# Altium project Thermistor_Expansion_Board.PrjPcb
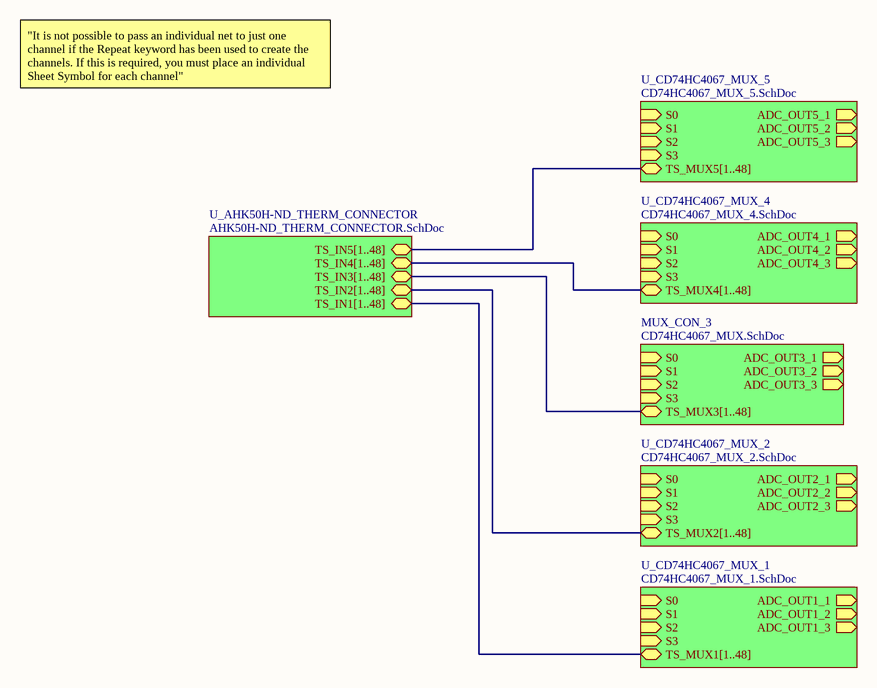
[diagram p0: TOP_SHEET.SchDoc]
6 sheets, 53 parts. Net scope: global (net labels, ports and power ports of the same name join across sheets).
Board file: MUX_Connectivity.PcbDoc
Sheets:
  TOP_SHEET.SchDoc
    MUX_CON_3 = CD74HC4067_MUX.SchDoc
    U_AHK50H-ND_THERM_CONNECTOR = AHK50H-ND_THERM_CONNECTOR.SchDoc
    U_CD74HC4067_MUX_5 = CD74HC4067_MUX_5.SchDoc
    U_CD74HC4067_MUX_2 = CD74HC4067_MUX_2.SchDoc
    U_CD74HC4067_MUX_1 = CD74HC4067_MUX_1.SchDoc

## Sheet TOP_SHEET.SchDoc
size A

### Sub-sheets
MUX_CON_3 = CD74HC4067_MUX.SchDoc: TS_MUX3[1..48] (bidir), S0 (in), S1 (in), S2 (in), S3 (in), ADC_OUT3_1 (out), ADC_OUT3_2 (out), ADC_OUT3_3 (out)
U_AHK50H-ND_THERM_CONNECTOR = AHK50H-ND_THERM_CONNECTOR.SchDoc: TS_IN3[1..48] (bidir), TS_IN2[1..48] (bidir), TS_IN1[1..48] (bidir), TS_IN4[1..48] (bidir), TS_IN5[1..48] (bidir)
U_CD74HC4067_MUX_1 = CD74HC4067_MUX_1.SchDoc: S0 (in), S1 (in), S2 (in), S3 (in), ADC_OUT1_1 (out), ADC_OUT1_2 (out), ADC_OUT1_3 (out), TS_MUX1[1..48] (bidir)
U_CD74HC4067_MUX_2 = CD74HC4067_MUX_2.SchDoc: S0 (in), S1 (in), S2 (in), S3 (in), ADC_OUT2_1 (out), ADC_OUT2_2 (out), ADC_OUT2_3 (out), TS_MUX2[1..48] (bidir)
U_CD74HC4067_MUX_4 = CD74HC4067_MUX_4.SchDoc (file not in this document): S0 (in), S1 (in), S2 (in), S3 (in), ADC_OUT4_1 (out), ADC_OUT4_2 (out), ADC_OUT4_3 (out), TS_MUX4[1..48] (bidir)
U_CD74HC4067_MUX_5 = CD74HC4067_MUX_5.SchDoc: S0 (in), S1 (in), S2 (in), S3 (in), ADC_OUT5_1 (out), ADC_OUT5_2 (out), ADC_OUT5_3 (out), TS_MUX5[1..48] (bidir)

### Buses and harness runs
bus sheet MUX_CON_3/TS_MUX3[1..48] = sheet U_AHK50H-ND_THERM_CONNECTOR/TS_IN3[1..48]
bus sheet U_AHK50H-ND_THERM_CONNECTOR/TS_IN1[1..48] = sheet U_CD74HC4067_MUX_1/TS_MUX1[1..48]
bus sheet U_AHK50H-ND_THERM_CONNECTOR/TS_IN2[1..48] = sheet U_CD74HC4067_MUX_2/TS_MUX2[1..48]
bus sheet U_AHK50H-ND_THERM_CONNECTOR/TS_IN4[1..48] = sheet U_CD74HC4067_MUX_4/TS_MUX4[1..48]
bus sheet U_AHK50H-ND_THERM_CONNECTOR/TS_IN5[1..48] = sheet U_CD74HC4067_MUX_5/TS_MUX5[1..48]

### Notes on the sheet
- "It is not possible to pass an individual net to just one channel if the Repeat keyword has been used to create the channels. If this is required, you must place an individual Sheet Symbol for each channel"

## Sheet CD74HC4067_MUX.SchDoc
size A
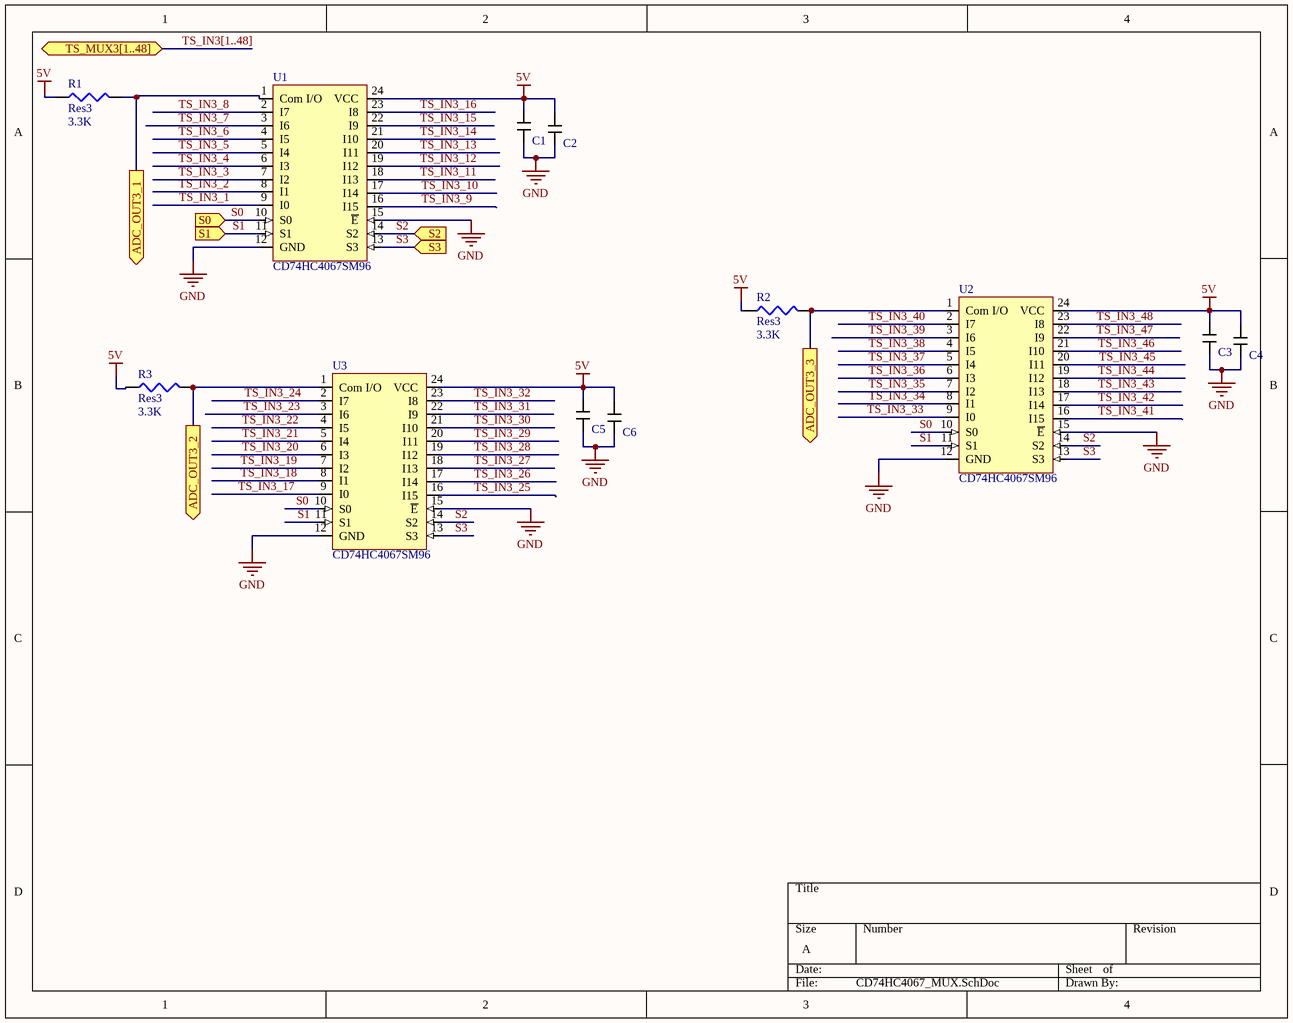
[diagram p1: CD74HC4067_MUX.SchDoc]

### Parts
C1  0.1uF Cap  [CAPC1608X09M]  (value not drawn)
C2  1uF Samsung Cap  [CAPC1608X09M]  (value not drawn)
C3  0.1uF Cap  [CAPC1608X09M]  (value not drawn)
C4  1uF Samsung Cap  [CAPC1608X09M]  (value not drawn)
C5  0.1uF Cap  [CAPC1608X09M]  (value not drawn)
C6  1uF Samsung Cap  [CAPC1608X09M]  (value not drawn)
R1  Res3  value 3.3K  [J1-0603]
R2  Res3  value 3.3K  [J1-0603]
R3  Res3  value 3.3K  [J1-0603]
U1  CD74HC4067SM96  [SOIC-24_MUX]
U2  CD74HC4067SM96  [SOIC-24_MUX]
U3  CD74HC4067SM96  [SOIC-24_MUX]

### Ports
ADC_OUT3_1 (out), ADC_OUT3_2 (out), ADC_OUT3_3 (out), S0 (in), S1 (in), S2 (in), S3 (in), TS_MUX3[1..48] (bidir)

### Nets
5V: C1.2 C2.2 C3.2 C4.2 C5.2 C6.2 R1.1 R2.1 R3.1 U1.24(VCC) U2.24(VCC) U3.24(VCC)
GND: C1.1 C2.1 C3.1 C4.1 C5.1 C6.1 U1.12(GND) U1.15(~{E}) U2.12(GND) U2.15(~{E}) U3.12(GND) U3.15(~{E})
S0: U1.10(S0) U2.10(S0) U3.10(S0) ; port S0
S1: U1.11(S1) U2.11(S1) U3.11(S1) ; port S1
S2: U1.14(S2) U2.14(S2) U3.14(S2) ; port S2
S3: U1.13(S3) U2.13(S3) U3.13(S3) ; port S3
TS_IN3_1: U1.9(I0)
TS_IN3_2: U1.8(I1)
TS_IN3_3: U1.7(I2)
TS_IN3_4: U1.6(I3)
TS_IN3_5: U1.5(I4)
TS_IN3_6: U1.4(I5)
TS_IN3_7: U1.3(I6)
TS_IN3_8: U1.2(I7)
TS_IN3_9: U1.16(I15)
TS_IN3_10: U1.17(I14)
TS_IN3_11: U1.18(I13)
TS_IN3_12: U1.19(I12)
TS_IN3_13: U1.20(I11)
TS_IN3_14: U1.21(I10)
TS_IN3_15: U1.22(I9)
TS_IN3_16: U1.23(I8)
TS_IN3_17: U3.9(I0)
TS_IN3_18: U3.8(I1)
TS_IN3_19: U3.7(I2)
TS_IN3_20: U3.6(I3)
TS_IN3_21: U3.5(I4)
TS_IN3_22: U3.4(I5)
TS_IN3_23: U3.3(I6)
TS_IN3_24: U3.2(I7)
TS_IN3_25: U3.16(I15)
TS_IN3_26: U3.17(I14)
TS_IN3_27: U3.18(I13)
TS_IN3_28: U3.19(I12)
TS_IN3_29: U3.20(I11)
TS_IN3_30: U3.21(I10)
TS_IN3_31: U3.22(I9)
TS_IN3_32: U3.23(I8)
TS_IN3_33: U2.9(I0)
TS_IN3_34: U2.8(I1)
TS_IN3_35: U2.7(I2)
TS_IN3_36: U2.6(I3)
TS_IN3_37: U2.5(I4)
TS_IN3_38: U2.4(I5)
TS_IN3_39: U2.3(I6)
TS_IN3_40: U2.2(I7)
TS_IN3_41: U2.16(I15)
TS_IN3_42: U2.17(I14)
TS_IN3_43: U2.18(I13)
TS_IN3_44: U2.19(I12)
TS_IN3_45: U2.20(I11)
TS_IN3_46: U2.21(I10)
TS_IN3_47: U2.22(I9)
TS_IN3_48: U2.23(I8)
NetR1_2: R1.2 U1.1(Com_I/O) ; port ADC_OUT3_1
NetR2_2: R2.2 U2.1(Com_I/O) ; port ADC_OUT3_3
NetR3_2: R3.2 U3.1(Com_I/O) ; port ADC_OUT3_2

### Buses and harness runs
bus TS_IN3[1..48] = port TS_MUX3[1..48]

### Library data of the parts
C1 C3 C5 = 0.1uF Cap: C0603C101K8GAC7867 Kemet Capacitor; Supplier 1: Digi-Key; Supplier Part Number 1: 399-14477-1-ND
R1-R3 = Res3: Resistor; Published: 8-Jun-2000; LatestRevisionDate: 29-May-2009; LatestRevisionNote: IPC-7351 Footprint Added.; PackageReference: J1-0603; Publisher: Altium Limited; PackageDescription: Chip Resistor
C2 C4 C6 = 1uF Samsung Cap: Supplier 1: Digi-Key; Supplier Part Number 1: 1276-1946-1-ND
U1-U3 = CD74HC4067SM96: Supplier Part Number 1: 05B6161; Supplier 1: Newark

## Sheet AHK50H-ND_THERM_CONNECTOR.SchDoc
size A
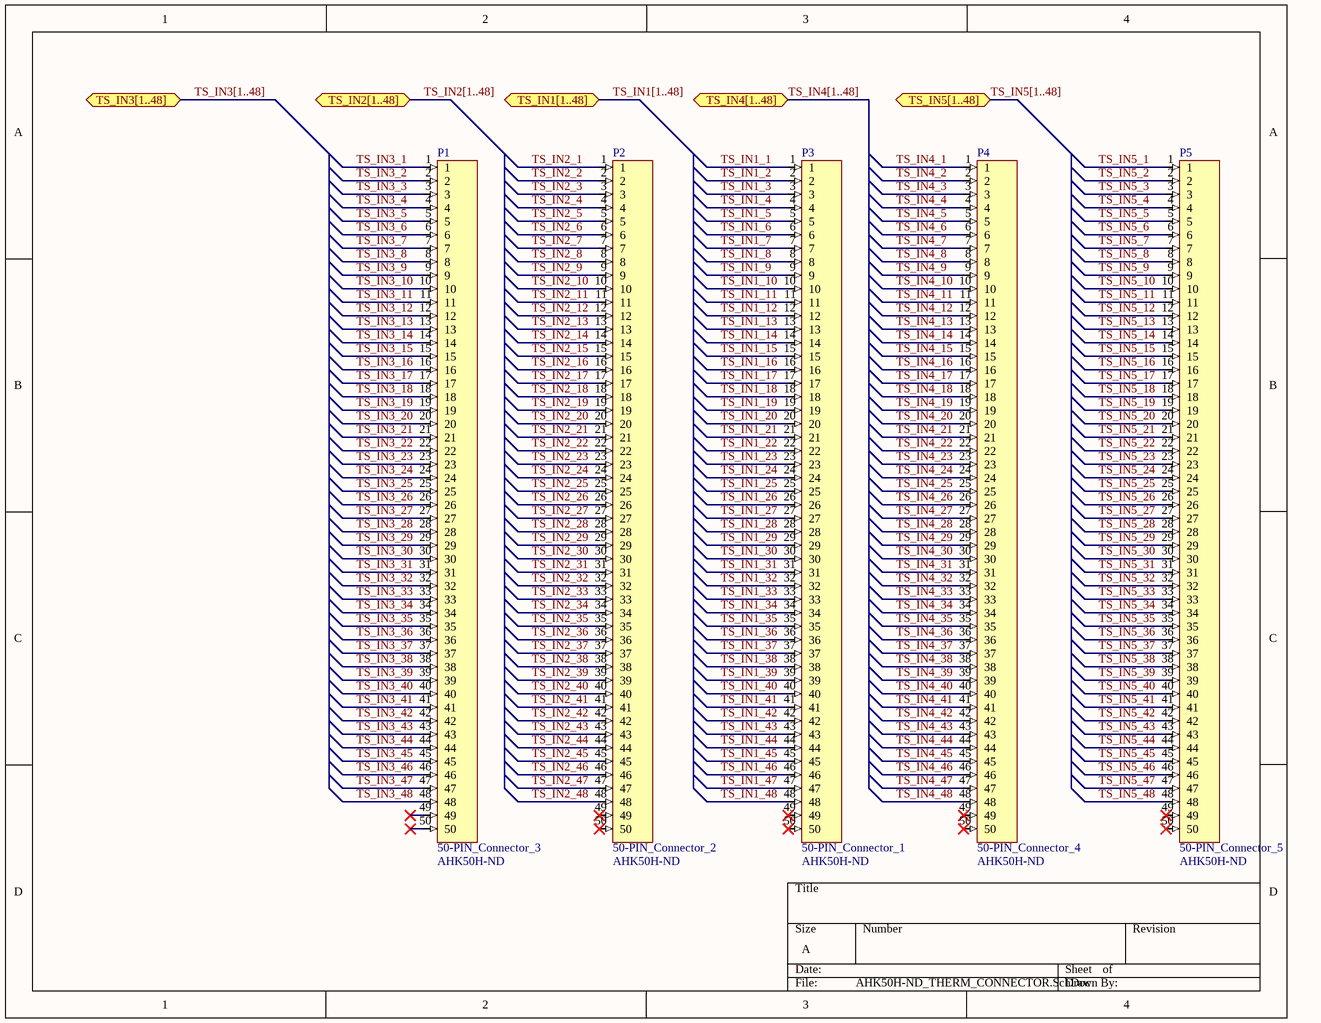
[diagram p2: AHK50H-ND_THERM_CONNECTOR.SchDoc]

### Parts
P1  50-PIN_Connector_3  Supplier Part Number 1: AHK50H-ND  [50_Pin_Connector]
P2  50-PIN_Connector_2  Supplier Part Number 1: AHK50H-ND  [50_Pin_Connector]
P3  50-PIN_Connector_1  Supplier Part Number 1: AHK50H-ND  [50_Pin_Connector]
P4  50-PIN_Connector_4  Supplier Part Number 1: AHK50H-ND  [50_Pin_Connector]
P5  50-PIN_Connector_5  Supplier Part Number 1: AHK50H-ND  [50_Pin_Connector]

### Ports
TS_IN1[1..48] (bidir), TS_IN2[1..48] (bidir), TS_IN3[1..48] (bidir), TS_IN4[1..48] (bidir), TS_IN5[1..48] (bidir)

### Nets
TS_IN1_1: P3.1
TS_IN1_2: P3.2
TS_IN1_3: P3.3
TS_IN1_4: P3.4
TS_IN1_5: P3.5
TS_IN1_6: P3.6
TS_IN1_7: P3.7
TS_IN1_8: P3.8
TS_IN1_9: P3.9
TS_IN1_10: P3.10
TS_IN1_11: P3.11
TS_IN1_12: P3.12
TS_IN1_13: P3.13
TS_IN1_14: P3.14
TS_IN1_15: P3.15
TS_IN1_16: P3.16
TS_IN1_17: P3.17
TS_IN1_18: P3.18
TS_IN1_19: P3.19
TS_IN1_20: P3.20
TS_IN1_21: P3.21
TS_IN1_22: P3.22
TS_IN1_23: P3.23
TS_IN1_24: P3.24
TS_IN1_25: P3.25
TS_IN1_26: P3.26
TS_IN1_27: P3.27
TS_IN1_28: P3.28
TS_IN1_29: P3.29
TS_IN1_30: P3.30
TS_IN1_31: P3.31
TS_IN1_32: P3.32
TS_IN1_33: P3.33
TS_IN1_34: P3.34
TS_IN1_35: P3.35
TS_IN1_36: P3.36
TS_IN1_37: P3.37
TS_IN1_38: P3.38
TS_IN1_39: P3.39
TS_IN1_40: P3.40
TS_IN1_41: P3.41
TS_IN1_42: P3.42
TS_IN1_43: P3.43
TS_IN1_44: P3.44
TS_IN1_45: P3.45
TS_IN1_46: P3.46
TS_IN1_47: P3.47
TS_IN1_48: P3.48
TS_IN2_1: P2.1
TS_IN2_2: P2.2
TS_IN2_3: P2.3
TS_IN2_4: P2.4
TS_IN2_5: P2.5
TS_IN2_6: P2.6
TS_IN2_7: P2.7
TS_IN2_8: P2.8
TS_IN2_9: P2.9
TS_IN2_10: P2.10
TS_IN2_11: P2.11
TS_IN2_12: P2.12
TS_IN2_13: P2.13
TS_IN2_14: P2.14
TS_IN2_15: P2.15
TS_IN2_16: P2.16
TS_IN2_17: P2.17
TS_IN2_18: P2.18
TS_IN2_19: P2.19
TS_IN2_20: P2.20
TS_IN2_21: P2.21
TS_IN2_22: P2.22
TS_IN2_23: P2.23
TS_IN2_24: P2.24
TS_IN2_25: P2.25
TS_IN2_26: P2.26
TS_IN2_27: P2.27
TS_IN2_28: P2.28
TS_IN2_29: P2.29
TS_IN2_30: P2.30
TS_IN2_31: P2.31
TS_IN2_32: P2.32
TS_IN2_33: P2.33
TS_IN2_34: P2.34
TS_IN2_35: P2.35
TS_IN2_36: P2.36
TS_IN2_37: P2.37
TS_IN2_38: P2.38
TS_IN2_39: P2.39
TS_IN2_40: P2.40
TS_IN2_41: P2.41
TS_IN2_42: P2.42
TS_IN2_43: P2.43
TS_IN2_44: P2.44
TS_IN2_45: P2.45
TS_IN2_46: P2.46
TS_IN2_47: P2.47
TS_IN2_48: P2.48
TS_IN3_1: P1.1
TS_IN3_2: P1.2
TS_IN3_3: P1.3
TS_IN3_4: P1.4
TS_IN3_5: P1.5
TS_IN3_6: P1.6
TS_IN3_7: P1.7
TS_IN3_8: P1.8
TS_IN3_9: P1.9
TS_IN3_10: P1.10
TS_IN3_11: P1.11
TS_IN3_12: P1.12
TS_IN3_13: P1.13
TS_IN3_14: P1.14
TS_IN3_15: P1.15
TS_IN3_16: P1.16
TS_IN3_17: P1.17
TS_IN3_18: P1.18
TS_IN3_19: P1.19
TS_IN3_20: P1.20
TS_IN3_21: P1.21
TS_IN3_22: P1.22
TS_IN3_23: P1.23
TS_IN3_24: P1.24
TS_IN3_25: P1.25
TS_IN3_26: P1.26
TS_IN3_27: P1.27
TS_IN3_28: P1.28
TS_IN3_29: P1.29
TS_IN3_30: P1.30
TS_IN3_31: P1.31
TS_IN3_32: P1.32
TS_IN3_33: P1.33
TS_IN3_34: P1.34
TS_IN3_35: P1.35
TS_IN3_36: P1.36
TS_IN3_37: P1.37
TS_IN3_38: P1.38
TS_IN3_39: P1.39
TS_IN3_40: P1.40
TS_IN3_41: P1.41
TS_IN3_42: P1.42
TS_IN3_43: P1.43
TS_IN3_44: P1.44
TS_IN3_45: P1.45
TS_IN3_46: P1.46
TS_IN3_47: P1.47
TS_IN3_48: P1.48
TS_IN4_1: P4.1
TS_IN4_2: P4.2
TS_IN4_3: P4.3
TS_IN4_4: P4.4
TS_IN4_5: P4.5
TS_IN4_6: P4.6
TS_IN4_7: P4.7
TS_IN4_8: P4.8
TS_IN4_9: P4.9
TS_IN4_10: P4.10
TS_IN4_11: P4.11
TS_IN4_12: P4.12
TS_IN4_13: P4.13
TS_IN4_14: P4.14
TS_IN4_15: P4.15
TS_IN4_16: P4.16
TS_IN4_17: P4.17
TS_IN4_18: P4.18
TS_IN4_19: P4.19
TS_IN4_20: P4.20
TS_IN4_21: P4.21
TS_IN4_22: P4.22
TS_IN4_23: P4.23
TS_IN4_24: P4.24
TS_IN4_25: P4.25
TS_IN4_26: P4.26
TS_IN4_27: P4.27
TS_IN4_28: P4.28
TS_IN4_29: P4.29
TS_IN4_30: P4.30
TS_IN4_31: P4.31
TS_IN4_32: P4.32
TS_IN4_33: P4.33
TS_IN4_34: P4.34
TS_IN4_35: P4.35
TS_IN4_36: P4.36
TS_IN4_37: P4.37
TS_IN4_38: P4.38
TS_IN4_39: P4.39
TS_IN4_40: P4.40
TS_IN4_41: P4.41
TS_IN4_42: P4.42
TS_IN4_43: P4.43
TS_IN4_44: P4.44
TS_IN4_45: P4.45
TS_IN4_46: P4.46
TS_IN4_47: P4.47
TS_IN4_48: P4.48
TS_IN5_1: P5.1
TS_IN5_2: P5.2
TS_IN5_3: P5.3
TS_IN5_4: P5.4
TS_IN5_5: P5.5
TS_IN5_6: P5.6
TS_IN5_7: P5.7
TS_IN5_8: P5.8
TS_IN5_9: P5.9
TS_IN5_10: P5.10
TS_IN5_11: P5.11
TS_IN5_12: P5.12
TS_IN5_13: P5.13
TS_IN5_14: P5.14
TS_IN5_15: P5.15
TS_IN5_16: P5.16
TS_IN5_17: P5.17
TS_IN5_18: P5.18
TS_IN5_19: P5.19
TS_IN5_20: P5.20
TS_IN5_21: P5.21
TS_IN5_22: P5.22
TS_IN5_23: P5.23
TS_IN5_24: P5.24
TS_IN5_25: P5.25
TS_IN5_26: P5.26
TS_IN5_27: P5.27
TS_IN5_28: P5.28
TS_IN5_29: P5.29
TS_IN5_30: P5.30
TS_IN5_31: P5.31
TS_IN5_32: P5.32
TS_IN5_33: P5.33
TS_IN5_34: P5.34
TS_IN5_35: P5.35
TS_IN5_36: P5.36
TS_IN5_37: P5.37
TS_IN5_38: P5.38
TS_IN5_39: P5.39
TS_IN5_40: P5.40
TS_IN5_41: P5.41
TS_IN5_42: P5.42
TS_IN5_43: P5.43
TS_IN5_44: P5.44
TS_IN5_45: P5.45
TS_IN5_46: P5.46
TS_IN5_47: P5.47
TS_IN5_48: P5.48

Not connected (* = marked no-connect by the designer): P1 49* 50*; P2 49* 50*; P3 49* 50*; P4 49* 50*; P5 49* 50*

### Buses and harness runs
bus TS_IN1[1..48] = port TS_IN1[1..48]
bus TS_IN2[1..48] = port TS_IN2[1..48]
bus TS_IN3[1..48] = port TS_IN3[1..48]
bus TS_IN4[1..48] = port TS_IN4[1..48]
bus TS_IN5[1..48] = port TS_IN5[1..48]

### Library data of the parts
P1-P5 = 50-PIN_Connector: TE_CONN_VERT_50-PIN; Supplier 1: Digi-Key

## Sheet CD74HC4067_MUX_5.SchDoc
size A
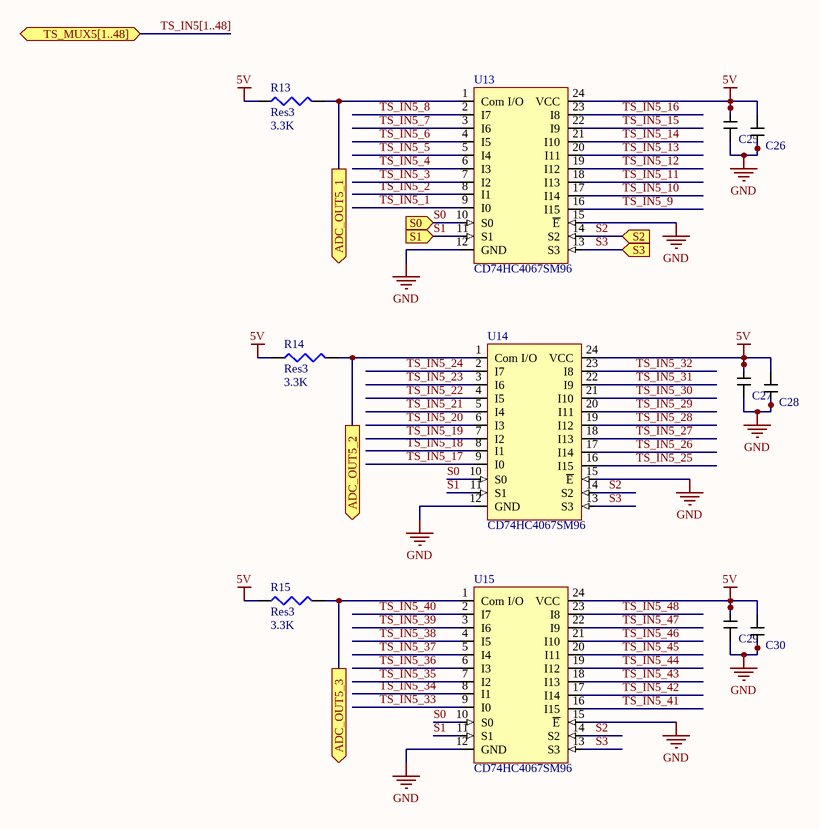
[diagram p3: CD74HC4067_MUX_5.SchDoc]

### Parts
C25  0.1uF Cap  [CAPC1608X09M]  (value not drawn)
C26  1uF Samsung Cap  [CAPC1608X09M]  (value not drawn)
C27  0.1uF Cap  [CAPC1608X09M]  (value not drawn)
C28  1uF Samsung Cap  [CAPC1608X09M]  (value not drawn)
C29  0.1uF Cap  [CAPC1608X09M]  (value not drawn)
C30  1uF Samsung Cap  [CAPC1608X09M]  (value not drawn)
R13  Res3  value 3.3K  [J1-0603]
R14  Res3  value 3.3K  [J1-0603]
R15  Res3  value 3.3K  [J1-0603]
U13  CD74HC4067SM96  [SOIC-24_MUX]
U14  CD74HC4067SM96  [SOIC-24_MUX]
U15  CD74HC4067SM96  [SOIC-24_MUX]

### Ports
ADC_OUT5_1 (out), ADC_OUT5_2 (out), ADC_OUT5_3 (out), S0 (in), S1 (in), S2 (in), S3 (in), TS_MUX5[1..48] (bidir)

### Nets
5V: C25.2 C26.2 C27.2 C28.2 C29.2 C30.2 R13.1 R14.1 R15.1 U13.24(VCC) U14.24(VCC) U15.24(VCC)
GND: C25.1 C26.1 C27.1 C28.1 C29.1 C30.1 U13.12(GND) U13.15(~{E}) U14.12(GND) U14.15(~{E}) U15.12(GND) U15.15(~{E})
S0: U13.10(S0) U14.10(S0) U15.10(S0) ; port S0
S1: U13.11(S1) U14.11(S1) U15.11(S1) ; port S1
S2: U13.14(S2) U14.14(S2) U15.14(S2) ; port S2
S3: U13.13(S3) U14.13(S3) U15.13(S3) ; port S3
TS_IN5_1: U13.9(I0)
TS_IN5_2: U13.8(I1)
TS_IN5_3: U13.7(I2)
TS_IN5_4: U13.6(I3)
TS_IN5_5: U13.5(I4)
TS_IN5_6: U13.4(I5)
TS_IN5_7: U13.3(I6)
TS_IN5_8: U13.2(I7)
TS_IN5_9: U13.16(I15)
TS_IN5_10: U13.17(I14)
TS_IN5_11: U13.18(I13)
TS_IN5_12: U13.19(I12)
TS_IN5_13: U13.20(I11)
TS_IN5_14: U13.21(I10)
TS_IN5_15: U13.22(I9)
TS_IN5_16: U13.23(I8)
TS_IN5_17: U14.9(I0)
TS_IN5_18: U14.8(I1)
TS_IN5_19: U14.7(I2)
TS_IN5_20: U14.6(I3)
TS_IN5_21: U14.5(I4)
TS_IN5_22: U14.4(I5)
TS_IN5_23: U14.3(I6)
TS_IN5_24: U14.2(I7)
TS_IN5_25: U14.16(I15)
TS_IN5_26: U14.17(I14)
TS_IN5_27: U14.18(I13)
TS_IN5_28: U14.19(I12)
TS_IN5_29: U14.20(I11)
TS_IN5_30: U14.21(I10)
TS_IN5_31: U14.22(I9)
TS_IN5_32: U14.23(I8)
TS_IN5_33: U15.9(I0)
TS_IN5_34: U15.8(I1)
TS_IN5_35: U15.7(I2)
TS_IN5_36: U15.6(I3)
TS_IN5_37: U15.5(I4)
TS_IN5_38: U15.4(I5)
TS_IN5_39: U15.3(I6)
TS_IN5_40: U15.2(I7)
TS_IN5_41: U15.16(I15)
TS_IN5_42: U15.17(I14)
TS_IN5_43: U15.18(I13)
TS_IN5_44: U15.19(I12)
TS_IN5_45: U15.20(I11)
TS_IN5_46: U15.21(I10)
TS_IN5_47: U15.22(I9)
TS_IN5_48: U15.23(I8)
NetR13_2: R13.2 U13.1(Com_I/O) ; port ADC_OUT5_1
NetR14_2: R14.2 U14.1(Com_I/O) ; port ADC_OUT5_2
NetR15_2: R15.2 U15.1(Com_I/O) ; port ADC_OUT5_3

### Buses and harness runs
bus TS_IN5[1..48] = port TS_MUX5[1..48]

### Library data of the parts
C25 C27 C29 = 0.1uF Cap: C0603C101K8GAC7867 Kemet Capacitor; Supplier 1: Digi-Key; Supplier Part Number 1: 399-14477-1-ND
R13-R15 = Res3: Resistor; Published: 8-Jun-2000; LatestRevisionDate: 29-May-2009; LatestRevisionNote: IPC-7351 Footprint Added.; PackageReference: J1-0603; Publisher: Altium Limited; PackageDescription: Chip Resistor
C26 C28 C30 = 1uF Samsung Cap: Supplier 1: Digi-Key; Supplier Part Number 1: 1276-1946-1-ND
U13-U15 = CD74HC4067SM96: Supplier Part Number 1: 05B6161; Supplier 1: Newark

## Sheet CD74HC4067_MUX_2.SchDoc
size A
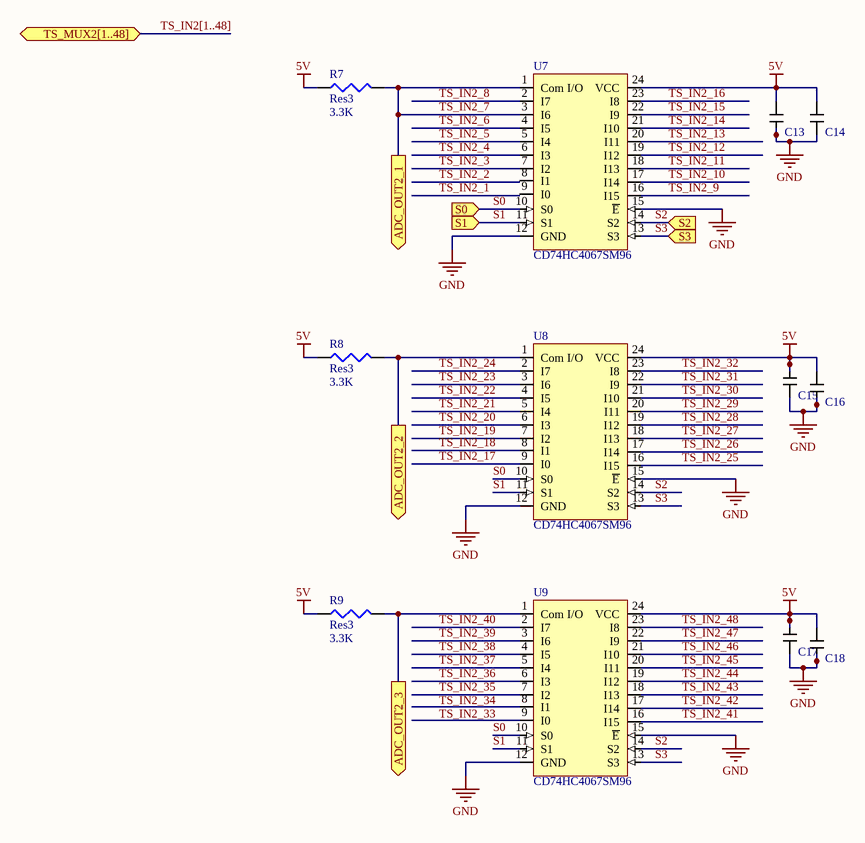
[diagram p4: CD74HC4067_MUX_2.SchDoc]

### Parts
C13  0.1uF Cap  [CAPC1608X09M]  (value not drawn)
C14  1uF Samsung Cap  [CAPC1608X09M]  (value not drawn)
C15  0.1uF Cap  [CAPC1608X09M]  (value not drawn)
C16  1uF Samsung Cap  [CAPC1608X09M]  (value not drawn)
C17  0.1uF Cap  [CAPC1608X09M]  (value not drawn)
C18  1uF Samsung Cap  [CAPC1608X09M]  (value not drawn)
R7  Res3  value 3.3K  [J1-0603]
R8  Res3  value 3.3K  [J1-0603]
R9  Res3  value 3.3K  [J1-0603]
U7  CD74HC4067SM96  [SOIC-24_MUX]
U8  CD74HC4067SM96  [SOIC-24_MUX]
U9  CD74HC4067SM96  [SOIC-24_MUX]

### Ports
ADC_OUT2_1 (out), ADC_OUT2_2 (out), ADC_OUT2_3 (out), S0 (in), S1 (in), S2 (in), S3 (in), TS_MUX2[1..48] (bidir)

### Nets
5V: C13.2 C14.2 C15.2 C16.2 C17.2 C18.2 R7.1 R8.1 R9.1 U7.24(VCC) U8.24(VCC) U9.24(VCC)
GND: C13.1 C14.1 C15.1 C16.1 C17.1 C18.1 U7.12(GND) U7.15(~{E}) U8.12(GND) U8.15(~{E}) U9.12(GND) U9.15(~{E})
S0: U7.10(S0) U8.10(S0) U9.10(S0) ; port S0
S1: U7.11(S1) U8.11(S1) U9.11(S1) ; port S1
S2: U7.14(S2) U8.14(S2) U9.14(S2) ; port S2
S3: U7.13(S3) U8.13(S3) U9.13(S3) ; port S3
TS_IN2_3: U7.7(I2)
TS_IN2_4: U7.6(I3)
TS_IN2_5: U7.5(I4)
TS_IN2_6: U7.4(I5)
TS_IN2_7: R7.2 U7.1(Com_I/O) U7.3(I6) ; port ADC_OUT2_1
TS_IN2_8: U7.2(I7)
TS_IN2_9: U7.16(I15)
TS_IN2_10: U7.17(I14)
TS_IN2_11: U7.18(I13)
TS_IN2_12: U7.19(I12)
TS_IN2_13: U7.20(I11)
TS_IN2_14: U7.21(I10)
TS_IN2_15: U7.22(I9)
TS_IN2_16: U7.23(I8)
TS_IN2_17: U8.9(I0)
TS_IN2_18: U8.8(I1)
TS_IN2_19: U8.7(I2)
TS_IN2_20: U8.6(I3)
TS_IN2_21: U8.5(I4)
TS_IN2_22: U8.4(I5)
TS_IN2_23: U8.3(I6)
TS_IN2_24: U8.2(I7)
TS_IN2_25: U8.16(I15)
TS_IN2_26: U8.17(I14)
TS_IN2_27: U8.18(I13)
TS_IN2_28: U8.19(I12)
TS_IN2_29: U8.20(I11)
TS_IN2_30: U8.21(I10)
TS_IN2_31: U8.22(I9)
TS_IN2_32: U8.23(I8)
TS_IN2_35: U9.7(I2)
TS_IN2_36: U9.6(I3)
TS_IN2_37: U9.5(I4)
TS_IN2_38: U9.4(I5)
TS_IN2_39: U9.3(I6)
TS_IN2_40: U9.2(I7)
TS_IN2_41: U9.16(I15)
TS_IN2_42: U9.17(I14)
TS_IN2_43: U9.18(I13)
TS_IN2_44: U9.19(I12)
TS_IN2_45: U9.20(I11)
TS_IN2_46: U9.21(I10)
TS_IN2_47: U9.22(I9)
TS_IN2_48: U9.23(I8)
NetR8_2: R8.2 U8.1(Com_I/O) ; port ADC_OUT2_2
NetR9_2: R9.2 U9.1(Com_I/O) ; port ADC_OUT2_3

Not connected (* = marked no-connect by the designer): U7 8(I1) 9(I0); U9 8(I1) 9(I0)

### Buses and harness runs
bus TS_IN2[1..48] = port TS_MUX2[1..48]

### Notes on the sheet
- Labels drawn without touching a wire or pin: TS_IN2_33, TS_IN2_34

### Library data of the parts
C13 C15 C17 = 0.1uF Cap: C0603C101K8GAC7867 Kemet Capacitor; Supplier 1: Digi-Key; Supplier Part Number 1: 399-14477-1-ND
R7-R9 = Res3: Resistor; Published: 8-Jun-2000; LatestRevisionDate: 29-May-2009; LatestRevisionNote: IPC-7351 Footprint Added.; PackageReference: J1-0603; Publisher: Altium Limited; PackageDescription: Chip Resistor
C14 C16 C18 = 1uF Samsung Cap: Supplier 1: Digi-Key; Supplier Part Number 1: 1276-1946-1-ND
U7-U9 = CD74HC4067SM96: Supplier Part Number 1: 05B6161; Supplier 1: Newark

## Sheet CD74HC4067_MUX_1.SchDoc
size A
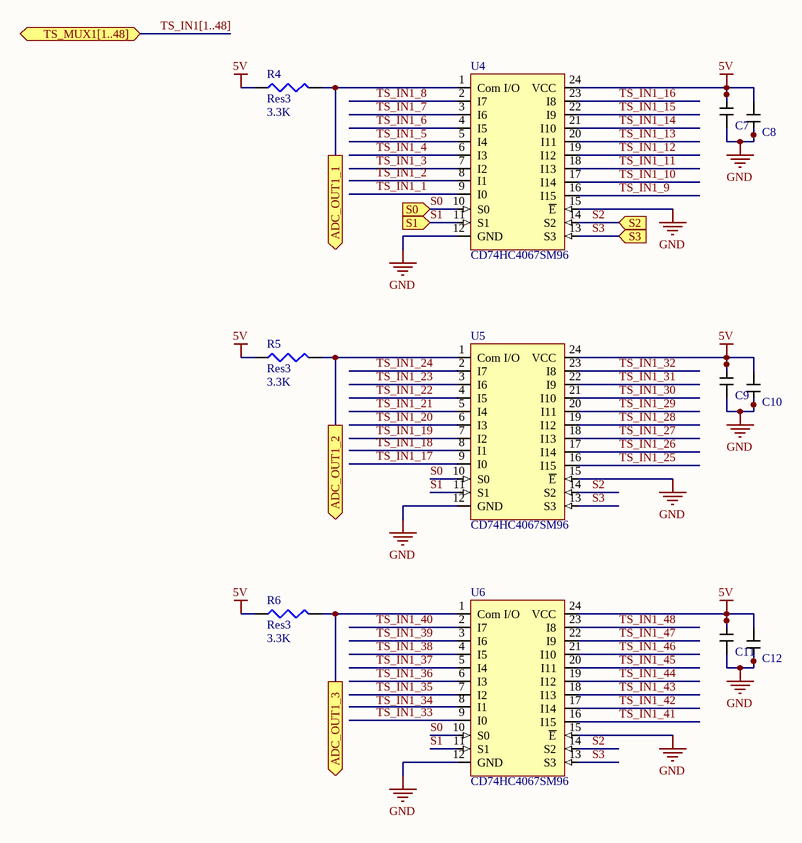
[diagram p5: CD74HC4067_MUX_1.SchDoc]

### Parts
C7  0.1uF Cap  [CAPC1608X09M]  (value not drawn)
C8  1uF Samsung Cap  [CAPC1608X09M]  (value not drawn)
C9  0.1uF Cap  [CAPC1608X09M]  (value not drawn)
C10  1uF Samsung Cap  [CAPC1608X09M]  (value not drawn)
C11  0.1uF Cap  [CAPC1608X09M]  (value not drawn)
C12  1uF Samsung Cap  [CAPC1608X09M]  (value not drawn)
R4  Res3  value 3.3K  [J1-0603]
R5  Res3  value 3.3K  [J1-0603]
R6  Res3  value 3.3K  [J1-0603]
U4  CD74HC4067SM96  [SOIC-24_MUX]
U5  CD74HC4067SM96  [SOIC-24_MUX]
U6  CD74HC4067SM96  [SOIC-24_MUX]

### Ports
ADC_OUT1_1 (out), ADC_OUT1_2 (out), ADC_OUT1_3 (out), S0 (in), S1 (in), S2 (in), S3 (in), TS_MUX1[1..48] (bidir)

### Nets
5V: C7.2 C8.2 C9.2 C10.2 C11.2 C12.2 R4.1 R5.1 R6.1 U4.24(VCC) U5.24(VCC) U6.24(VCC)
GND: C7.1 C8.1 C9.1 C10.1 C11.1 C12.1 U4.12(GND) U4.15(~{E}) U5.12(GND) U5.15(~{E}) U6.12(GND) U6.15(~{E})
S0: U4.10(S0) U5.10(S0) U6.10(S0) ; port S0
S1: U4.11(S1) U5.11(S1) U6.11(S1) ; port S1
S2: U4.14(S2) U5.14(S2) U6.14(S2) ; port S2
S3: U4.13(S3) U5.13(S3) U6.13(S3) ; port S3
TS_IN1_1: U4.9(I0)
TS_IN1_2: U4.8(I1)
TS_IN1_3: U4.7(I2)
TS_IN1_4: U4.6(I3)
TS_IN1_5: U4.5(I4)
TS_IN1_6: U4.4(I5)
TS_IN1_7: U4.3(I6)
TS_IN1_8: U4.2(I7)
TS_IN1_9: U4.16(I15)
TS_IN1_10: U4.17(I14)
TS_IN1_11: U4.18(I13)
TS_IN1_12: U4.19(I12)
TS_IN1_13: U4.20(I11)
TS_IN1_14: U4.21(I10)
TS_IN1_15: U4.22(I9)
TS_IN1_16: U4.23(I8)
TS_IN1_17: U5.9(I0)
TS_IN1_18: U5.8(I1)
TS_IN1_19: U5.7(I2)
TS_IN1_20: U5.6(I3)
TS_IN1_21: U5.5(I4)
TS_IN1_22: U5.4(I5)
TS_IN1_23: U5.3(I6)
TS_IN1_24: U5.2(I7)
TS_IN1_25: U5.16(I15)
TS_IN1_26: U5.17(I14)
TS_IN1_27: U5.18(I13)
TS_IN1_28: U5.19(I12)
TS_IN1_29: U5.20(I11)
TS_IN1_30: U5.21(I10)
TS_IN1_31: U5.22(I9)
TS_IN1_32: U5.23(I8)
TS_IN1_33: U6.9(I0)
TS_IN1_35: U6.7(I2)
TS_IN1_36: U6.6(I3)
TS_IN1_37: U6.5(I4)
TS_IN1_38: U6.4(I5)
TS_IN1_39: U6.3(I6)
TS_IN1_40: U6.2(I7)
TS_IN1_41: U6.16(I15)
TS_IN1_42: U6.17(I14)
TS_IN1_43: U6.18(I13)
TS_IN1_44: U6.19(I12)
TS_IN1_45: U6.20(I11)
TS_IN1_46: U6.21(I10)
TS_IN1_47: U6.22(I9)
TS_IN1_48: U6.23(I8)
NetR4_2: R4.2 U4.1(Com_I/O) ; port ADC_OUT1_1
NetR5_2: R5.2 U5.1(Com_I/O) ; port ADC_OUT1_2
NetR6_2: R6.2 U6.1(Com_I/O) ; port ADC_OUT1_3

Not connected (* = marked no-connect by the designer): U6 8(I1)

### Buses and harness runs
bus TS_IN1[1..48] = port TS_MUX1[1..48]

### Notes on the sheet
- Labels drawn without touching a wire or pin: TS_IN1_34

### Library data of the parts
C7 C9 C11 = 0.1uF Cap: C0603C101K8GAC7867 Kemet Capacitor; Supplier 1: Digi-Key; Supplier Part Number 1: 399-14477-1-ND
R4-R6 = Res3: Resistor; Published: 8-Jun-2000; LatestRevisionDate: 29-May-2009; LatestRevisionNote: IPC-7351 Footprint Added.; PackageReference: J1-0603; Publisher: Altium Limited; PackageDescription: Chip Resistor
C8 C10 C12 = 1uF Samsung Cap: Supplier 1: Digi-Key; Supplier Part Number 1: 1276-1946-1-ND
U4-U6 = CD74HC4067SM96: Supplier Part Number 1: 05B6161; Supplier 1: Newark

## Nets that join several sheets
5V: CD74HC4067_MUX (12 pins), CD74HC4067_MUX_5 (12 pins), CD74HC4067_MUX_2 (12 pins), CD74HC4067_MUX_1 (12 pins)
GND: CD74HC4067_MUX (12 pins), CD74HC4067_MUX_5 (12 pins), CD74HC4067_MUX_2 (12 pins), CD74HC4067_MUX_1 (12 pins)
S0: CD74HC4067_MUX (U1.10 U2.10 U3.10), CD74HC4067_MUX_5 (U13.10 U14.10 U15.10), CD74HC4067_MUX_2 (U7.10 U8.10 U9.10), CD74HC4067_MUX_1 (U4.10 U5.10 U6.10)
S1: CD74HC4067_MUX (U1.11 U2.11 U3.11), CD74HC4067_MUX_5 (U13.11 U14.11 U15.11), CD74HC4067_MUX_2 (U7.11 U8.11 U9.11), CD74HC4067_MUX_1 (U4.11 U5.11 U6.11)
S2: CD74HC4067_MUX (U1.14 U2.14 U3.14), CD74HC4067_MUX_5 (U13.14 U14.14 U15.14), CD74HC4067_MUX_2 (U7.14 U8.14 U9.14), CD74HC4067_MUX_1 (U4.14 U5.14 U6.14)
S3: CD74HC4067_MUX (U1.13 U2.13 U3.13), CD74HC4067_MUX_5 (U13.13 U14.13 U15.13), CD74HC4067_MUX_2 (U7.13 U8.13 U9.13), CD74HC4067_MUX_1 (U4.13 U5.13 U6.13)
TS_IN1_1: AHK50H-ND_THERM_CONNECTOR (P3.1), CD74HC4067_MUX_1 (U4.9)
TS_IN1_2: AHK50H-ND_THERM_CONNECTOR (P3.2), CD74HC4067_MUX_1 (U4.8)
TS_IN1_3: AHK50H-ND_THERM_CONNECTOR (P3.3), CD74HC4067_MUX_1 (U4.7)
TS_IN1_4: AHK50H-ND_THERM_CONNECTOR (P3.4), CD74HC4067_MUX_1 (U4.6)
TS_IN1_5: AHK50H-ND_THERM_CONNECTOR (P3.5), CD74HC4067_MUX_1 (U4.5)
TS_IN1_6: AHK50H-ND_THERM_CONNECTOR (P3.6), CD74HC4067_MUX_1 (U4.4)
TS_IN1_7: AHK50H-ND_THERM_CONNECTOR (P3.7), CD74HC4067_MUX_1 (U4.3)
TS_IN1_8: AHK50H-ND_THERM_CONNECTOR (P3.8), CD74HC4067_MUX_1 (U4.2)
TS_IN1_9: AHK50H-ND_THERM_CONNECTOR (P3.9), CD74HC4067_MUX_1 (U4.16)
TS_IN1_10: AHK50H-ND_THERM_CONNECTOR (P3.10), CD74HC4067_MUX_1 (U4.17)
TS_IN1_11: AHK50H-ND_THERM_CONNECTOR (P3.11), CD74HC4067_MUX_1 (U4.18)
TS_IN1_12: AHK50H-ND_THERM_CONNECTOR (P3.12), CD74HC4067_MUX_1 (U4.19)
TS_IN1_13: AHK50H-ND_THERM_CONNECTOR (P3.13), CD74HC4067_MUX_1 (U4.20)
TS_IN1_14: AHK50H-ND_THERM_CONNECTOR (P3.14), CD74HC4067_MUX_1 (U4.21)
TS_IN1_15: AHK50H-ND_THERM_CONNECTOR (P3.15), CD74HC4067_MUX_1 (U4.22)
TS_IN1_16: AHK50H-ND_THERM_CONNECTOR (P3.16), CD74HC4067_MUX_1 (U4.23)
TS_IN1_17: AHK50H-ND_THERM_CONNECTOR (P3.17), CD74HC4067_MUX_1 (U5.9)
TS_IN1_18: AHK50H-ND_THERM_CONNECTOR (P3.18), CD74HC4067_MUX_1 (U5.8)
TS_IN1_19: AHK50H-ND_THERM_CONNECTOR (P3.19), CD74HC4067_MUX_1 (U5.7)
TS_IN1_20: AHK50H-ND_THERM_CONNECTOR (P3.20), CD74HC4067_MUX_1 (U5.6)
TS_IN1_21: AHK50H-ND_THERM_CONNECTOR (P3.21), CD74HC4067_MUX_1 (U5.5)
TS_IN1_22: AHK50H-ND_THERM_CONNECTOR (P3.22), CD74HC4067_MUX_1 (U5.4)
TS_IN1_23: AHK50H-ND_THERM_CONNECTOR (P3.23), CD74HC4067_MUX_1 (U5.3)
TS_IN1_24: AHK50H-ND_THERM_CONNECTOR (P3.24), CD74HC4067_MUX_1 (U5.2)
TS_IN1_25: AHK50H-ND_THERM_CONNECTOR (P3.25), CD74HC4067_MUX_1 (U5.16)
TS_IN1_26: AHK50H-ND_THERM_CONNECTOR (P3.26), CD74HC4067_MUX_1 (U5.17)
TS_IN1_27: AHK50H-ND_THERM_CONNECTOR (P3.27), CD74HC4067_MUX_1 (U5.18)
TS_IN1_28: AHK50H-ND_THERM_CONNECTOR (P3.28), CD74HC4067_MUX_1 (U5.19)
TS_IN1_29: AHK50H-ND_THERM_CONNECTOR (P3.29), CD74HC4067_MUX_1 (U5.20)
TS_IN1_30: AHK50H-ND_THERM_CONNECTOR (P3.30), CD74HC4067_MUX_1 (U5.21)
TS_IN1_31: AHK50H-ND_THERM_CONNECTOR (P3.31), CD74HC4067_MUX_1 (U5.22)
TS_IN1_32: AHK50H-ND_THERM_CONNECTOR (P3.32), CD74HC4067_MUX_1 (U5.23)
TS_IN1_33: AHK50H-ND_THERM_CONNECTOR (P3.33), CD74HC4067_MUX_1 (U6.9)
TS_IN1_35: AHK50H-ND_THERM_CONNECTOR (P3.35), CD74HC4067_MUX_1 (U6.7)
TS_IN1_36: AHK50H-ND_THERM_CONNECTOR (P3.36), CD74HC4067_MUX_1 (U6.6)
TS_IN1_37: AHK50H-ND_THERM_CONNECTOR (P3.37), CD74HC4067_MUX_1 (U6.5)
TS_IN1_38: AHK50H-ND_THERM_CONNECTOR (P3.38), CD74HC4067_MUX_1 (U6.4)
TS_IN1_39: AHK50H-ND_THERM_CONNECTOR (P3.39), CD74HC4067_MUX_1 (U6.3)
TS_IN1_40: AHK50H-ND_THERM_CONNECTOR (P3.40), CD74HC4067_MUX_1 (U6.2)
TS_IN1_41: AHK50H-ND_THERM_CONNECTOR (P3.41), CD74HC4067_MUX_1 (U6.16)
TS_IN1_42: AHK50H-ND_THERM_CONNECTOR (P3.42), CD74HC4067_MUX_1 (U6.17)
TS_IN1_43: AHK50H-ND_THERM_CONNECTOR (P3.43), CD74HC4067_MUX_1 (U6.18)
TS_IN1_44: AHK50H-ND_THERM_CONNECTOR (P3.44), CD74HC4067_MUX_1 (U6.19)
TS_IN1_45: AHK50H-ND_THERM_CONNECTOR (P3.45), CD74HC4067_MUX_1 (U6.20)
TS_IN1_46: AHK50H-ND_THERM_CONNECTOR (P3.46), CD74HC4067_MUX_1 (U6.21)
TS_IN1_47: AHK50H-ND_THERM_CONNECTOR (P3.47), CD74HC4067_MUX_1 (U6.22)
TS_IN1_48: AHK50H-ND_THERM_CONNECTOR (P3.48), CD74HC4067_MUX_1 (U6.23)
TS_IN2_3: AHK50H-ND_THERM_CONNECTOR (P2.3), CD74HC4067_MUX_2 (U7.7)
TS_IN2_4: AHK50H-ND_THERM_CONNECTOR (P2.4), CD74HC4067_MUX_2 (U7.6)
TS_IN2_5: AHK50H-ND_THERM_CONNECTOR (P2.5), CD74HC4067_MUX_2 (U7.5)
TS_IN2_6: AHK50H-ND_THERM_CONNECTOR (P2.6), CD74HC4067_MUX_2 (U7.4)
TS_IN2_7: AHK50H-ND_THERM_CONNECTOR (P2.7), CD74HC4067_MUX_2 (R7.2 U7.1 U7.3)
TS_IN2_8: AHK50H-ND_THERM_CONNECTOR (P2.8), CD74HC4067_MUX_2 (U7.2)
TS_IN2_9: AHK50H-ND_THERM_CONNECTOR (P2.9), CD74HC4067_MUX_2 (U7.16)
TS_IN2_10: AHK50H-ND_THERM_CONNECTOR (P2.10), CD74HC4067_MUX_2 (U7.17)
TS_IN2_11: AHK50H-ND_THERM_CONNECTOR (P2.11), CD74HC4067_MUX_2 (U7.18)
TS_IN2_12: AHK50H-ND_THERM_CONNECTOR (P2.12), CD74HC4067_MUX_2 (U7.19)
TS_IN2_13: AHK50H-ND_THERM_CONNECTOR (P2.13), CD74HC4067_MUX_2 (U7.20)
TS_IN2_14: AHK50H-ND_THERM_CONNECTOR (P2.14), CD74HC4067_MUX_2 (U7.21)
TS_IN2_15: AHK50H-ND_THERM_CONNECTOR (P2.15), CD74HC4067_MUX_2 (U7.22)
TS_IN2_16: AHK50H-ND_THERM_CONNECTOR (P2.16), CD74HC4067_MUX_2 (U7.23)
TS_IN2_17: AHK50H-ND_THERM_CONNECTOR (P2.17), CD74HC4067_MUX_2 (U8.9)
TS_IN2_18: AHK50H-ND_THERM_CONNECTOR (P2.18), CD74HC4067_MUX_2 (U8.8)
TS_IN2_19: AHK50H-ND_THERM_CONNECTOR (P2.19), CD74HC4067_MUX_2 (U8.7)
TS_IN2_20: AHK50H-ND_THERM_CONNECTOR (P2.20), CD74HC4067_MUX_2 (U8.6)
TS_IN2_21: AHK50H-ND_THERM_CONNECTOR (P2.21), CD74HC4067_MUX_2 (U8.5)
TS_IN2_22: AHK50H-ND_THERM_CONNECTOR (P2.22), CD74HC4067_MUX_2 (U8.4)
TS_IN2_23: AHK50H-ND_THERM_CONNECTOR (P2.23), CD74HC4067_MUX_2 (U8.3)
TS_IN2_24: AHK50H-ND_THERM_CONNECTOR (P2.24), CD74HC4067_MUX_2 (U8.2)
TS_IN2_25: AHK50H-ND_THERM_CONNECTOR (P2.25), CD74HC4067_MUX_2 (U8.16)
TS_IN2_26: AHK50H-ND_THERM_CONNECTOR (P2.26), CD74HC4067_MUX_2 (U8.17)
TS_IN2_27: AHK50H-ND_THERM_CONNECTOR (P2.27), CD74HC4067_MUX_2 (U8.18)
TS_IN2_28: AHK50H-ND_THERM_CONNECTOR (P2.28), CD74HC4067_MUX_2 (U8.19)
TS_IN2_29: AHK50H-ND_THERM_CONNECTOR (P2.29), CD74HC4067_MUX_2 (U8.20)
TS_IN2_30: AHK50H-ND_THERM_CONNECTOR (P2.30), CD74HC4067_MUX_2 (U8.21)
TS_IN2_31: AHK50H-ND_THERM_CONNECTOR (P2.31), CD74HC4067_MUX_2 (U8.22)
TS_IN2_32: AHK50H-ND_THERM_CONNECTOR (P2.32), CD74HC4067_MUX_2 (U8.23)
TS_IN2_35: AHK50H-ND_THERM_CONNECTOR (P2.35), CD74HC4067_MUX_2 (U9.7)
TS_IN2_36: AHK50H-ND_THERM_CONNECTOR (P2.36), CD74HC4067_MUX_2 (U9.6)
TS_IN2_37: AHK50H-ND_THERM_CONNECTOR (P2.37), CD74HC4067_MUX_2 (U9.5)
TS_IN2_38: AHK50H-ND_THERM_CONNECTOR (P2.38), CD74HC4067_MUX_2 (U9.4)
TS_IN2_39: AHK50H-ND_THERM_CONNECTOR (P2.39), CD74HC4067_MUX_2 (U9.3)
TS_IN2_40: AHK50H-ND_THERM_CONNECTOR (P2.40), CD74HC4067_MUX_2 (U9.2)
TS_IN2_41: AHK50H-ND_THERM_CONNECTOR (P2.41), CD74HC4067_MUX_2 (U9.16)
TS_IN2_42: AHK50H-ND_THERM_CONNECTOR (P2.42), CD74HC4067_MUX_2 (U9.17)
TS_IN2_43: AHK50H-ND_THERM_CONNECTOR (P2.43), CD74HC4067_MUX_2 (U9.18)
TS_IN2_44: AHK50H-ND_THERM_CONNECTOR (P2.44), CD74HC4067_MUX_2 (U9.19)
TS_IN2_45: AHK50H-ND_THERM_CONNECTOR (P2.45), CD74HC4067_MUX_2 (U9.20)
TS_IN2_46: AHK50H-ND_THERM_CONNECTOR (P2.46), CD74HC4067_MUX_2 (U9.21)
TS_IN2_47: AHK50H-ND_THERM_CONNECTOR (P2.47), CD74HC4067_MUX_2 (U9.22)
TS_IN2_48: AHK50H-ND_THERM_CONNECTOR (P2.48), CD74HC4067_MUX_2 (U9.23)
TS_IN3_1: CD74HC4067_MUX (U1.9), AHK50H-ND_THERM_CONNECTOR (P1.1)
TS_IN3_2: CD74HC4067_MUX (U1.8), AHK50H-ND_THERM_CONNECTOR (P1.2)
TS_IN3_3: CD74HC4067_MUX (U1.7), AHK50H-ND_THERM_CONNECTOR (P1.3)
TS_IN3_4: CD74HC4067_MUX (U1.6), AHK50H-ND_THERM_CONNECTOR (P1.4)
TS_IN3_5: CD74HC4067_MUX (U1.5), AHK50H-ND_THERM_CONNECTOR (P1.5)
TS_IN3_6: CD74HC4067_MUX (U1.4), AHK50H-ND_THERM_CONNECTOR (P1.6)
TS_IN3_7: CD74HC4067_MUX (U1.3), AHK50H-ND_THERM_CONNECTOR (P1.7)
TS_IN3_8: CD74HC4067_MUX (U1.2), AHK50H-ND_THERM_CONNECTOR (P1.8)
TS_IN3_9: CD74HC4067_MUX (U1.16), AHK50H-ND_THERM_CONNECTOR (P1.9)
TS_IN3_10: CD74HC4067_MUX (U1.17), AHK50H-ND_THERM_CONNECTOR (P1.10)
TS_IN3_11: CD74HC4067_MUX (U1.18), AHK50H-ND_THERM_CONNECTOR (P1.11)
TS_IN3_12: CD74HC4067_MUX (U1.19), AHK50H-ND_THERM_CONNECTOR (P1.12)
TS_IN3_13: CD74HC4067_MUX (U1.20), AHK50H-ND_THERM_CONNECTOR (P1.13)
TS_IN3_14: CD74HC4067_MUX (U1.21), AHK50H-ND_THERM_CONNECTOR (P1.14)
TS_IN3_15: CD74HC4067_MUX (U1.22), AHK50H-ND_THERM_CONNECTOR (P1.15)
TS_IN3_16: CD74HC4067_MUX (U1.23), AHK50H-ND_THERM_CONNECTOR (P1.16)
TS_IN3_17: CD74HC4067_MUX (U3.9), AHK50H-ND_THERM_CONNECTOR (P1.17)
TS_IN3_18: CD74HC4067_MUX (U3.8), AHK50H-ND_THERM_CONNECTOR (P1.18)
TS_IN3_19: CD74HC4067_MUX (U3.7), AHK50H-ND_THERM_CONNECTOR (P1.19)
TS_IN3_20: CD74HC4067_MUX (U3.6), AHK50H-ND_THERM_CONNECTOR (P1.20)
TS_IN3_21: CD74HC4067_MUX (U3.5), AHK50H-ND_THERM_CONNECTOR (P1.21)
TS_IN3_22: CD74HC4067_MUX (U3.4), AHK50H-ND_THERM_CONNECTOR (P1.22)
TS_IN3_23: CD74HC4067_MUX (U3.3), AHK50H-ND_THERM_CONNECTOR (P1.23)
TS_IN3_24: CD74HC4067_MUX (U3.2), AHK50H-ND_THERM_CONNECTOR (P1.24)
TS_IN3_25: CD74HC4067_MUX (U3.16), AHK50H-ND_THERM_CONNECTOR (P1.25)
TS_IN3_26: CD74HC4067_MUX (U3.17), AHK50H-ND_THERM_CONNECTOR (P1.26)
TS_IN3_27: CD74HC4067_MUX (U3.18), AHK50H-ND_THERM_CONNECTOR (P1.27)
TS_IN3_28: CD74HC4067_MUX (U3.19), AHK50H-ND_THERM_CONNECTOR (P1.28)
TS_IN3_29: CD74HC4067_MUX (U3.20), AHK50H-ND_THERM_CONNECTOR (P1.29)
TS_IN3_30: CD74HC4067_MUX (U3.21), AHK50H-ND_THERM_CONNECTOR (P1.30)
TS_IN3_31: CD74HC4067_MUX (U3.22), AHK50H-ND_THERM_CONNECTOR (P1.31)
TS_IN3_32: CD74HC4067_MUX (U3.23), AHK50H-ND_THERM_CONNECTOR (P1.32)
TS_IN3_33: CD74HC4067_MUX (U2.9), AHK50H-ND_THERM_CONNECTOR (P1.33)
TS_IN3_34: CD74HC4067_MUX (U2.8), AHK50H-ND_THERM_CONNECTOR (P1.34)
TS_IN3_35: CD74HC4067_MUX (U2.7), AHK50H-ND_THERM_CONNECTOR (P1.35)
TS_IN3_36: CD74HC4067_MUX (U2.6), AHK50H-ND_THERM_CONNECTOR (P1.36)
TS_IN3_37: CD74HC4067_MUX (U2.5), AHK50H-ND_THERM_CONNECTOR (P1.37)
TS_IN3_38: CD74HC4067_MUX (U2.4), AHK50H-ND_THERM_CONNECTOR (P1.38)
TS_IN3_39: CD74HC4067_MUX (U2.3), AHK50H-ND_THERM_CONNECTOR (P1.39)
TS_IN3_40: CD74HC4067_MUX (U2.2), AHK50H-ND_THERM_CONNECTOR (P1.40)
TS_IN3_41: CD74HC4067_MUX (U2.16), AHK50H-ND_THERM_CONNECTOR (P1.41)
TS_IN3_42: CD74HC4067_MUX (U2.17), AHK50H-ND_THERM_CONNECTOR (P1.42)
TS_IN3_43: CD74HC4067_MUX (U2.18), AHK50H-ND_THERM_CONNECTOR (P1.43)
TS_IN3_44: CD74HC4067_MUX (U2.19), AHK50H-ND_THERM_CONNECTOR (P1.44)
TS_IN3_45: CD74HC4067_MUX (U2.20), AHK50H-ND_THERM_CONNECTOR (P1.45)
TS_IN3_46: CD74HC4067_MUX (U2.21), AHK50H-ND_THERM_CONNECTOR (P1.46)
TS_IN3_47: CD74HC4067_MUX (U2.22), AHK50H-ND_THERM_CONNECTOR (P1.47)
TS_IN3_48: CD74HC4067_MUX (U2.23), AHK50H-ND_THERM_CONNECTOR (P1.48)
TS_IN5_1: AHK50H-ND_THERM_CONNECTOR (P5.1), CD74HC4067_MUX_5 (U13.9)
TS_IN5_2: AHK50H-ND_THERM_CONNECTOR (P5.2), CD74HC4067_MUX_5 (U13.8)
TS_IN5_3: AHK50H-ND_THERM_CONNECTOR (P5.3), CD74HC4067_MUX_5 (U13.7)
TS_IN5_4: AHK50H-ND_THERM_CONNECTOR (P5.4), CD74HC4067_MUX_5 (U13.6)
TS_IN5_5: AHK50H-ND_THERM_CONNECTOR (P5.5), CD74HC4067_MUX_5 (U13.5)
TS_IN5_6: AHK50H-ND_THERM_CONNECTOR (P5.6), CD74HC4067_MUX_5 (U13.4)
TS_IN5_7: AHK50H-ND_THERM_CONNECTOR (P5.7), CD74HC4067_MUX_5 (U13.3)
TS_IN5_8: AHK50H-ND_THERM_CONNECTOR (P5.8), CD74HC4067_MUX_5 (U13.2)
TS_IN5_9: AHK50H-ND_THERM_CONNECTOR (P5.9), CD74HC4067_MUX_5 (U13.16)
TS_IN5_10: AHK50H-ND_THERM_CONNECTOR (P5.10), CD74HC4067_MUX_5 (U13.17)
TS_IN5_11: AHK50H-ND_THERM_CONNECTOR (P5.11), CD74HC4067_MUX_5 (U13.18)
TS_IN5_12: AHK50H-ND_THERM_CONNECTOR (P5.12), CD74HC4067_MUX_5 (U13.19)
TS_IN5_13: AHK50H-ND_THERM_CONNECTOR (P5.13), CD74HC4067_MUX_5 (U13.20)
TS_IN5_14: AHK50H-ND_THERM_CONNECTOR (P5.14), CD74HC4067_MUX_5 (U13.21)
TS_IN5_15: AHK50H-ND_THERM_CONNECTOR (P5.15), CD74HC4067_MUX_5 (U13.22)
TS_IN5_16: AHK50H-ND_THERM_CONNECTOR (P5.16), CD74HC4067_MUX_5 (U13.23)
TS_IN5_17: AHK50H-ND_THERM_CONNECTOR (P5.17), CD74HC4067_MUX_5 (U14.9)
TS_IN5_18: AHK50H-ND_THERM_CONNECTOR (P5.18), CD74HC4067_MUX_5 (U14.8)
TS_IN5_19: AHK50H-ND_THERM_CONNECTOR (P5.19), CD74HC4067_MUX_5 (U14.7)
TS_IN5_20: AHK50H-ND_THERM_CONNECTOR (P5.20), CD74HC4067_MUX_5 (U14.6)
TS_IN5_21: AHK50H-ND_THERM_CONNECTOR (P5.21), CD74HC4067_MUX_5 (U14.5)
TS_IN5_22: AHK50H-ND_THERM_CONNECTOR (P5.22), CD74HC4067_MUX_5 (U14.4)
TS_IN5_23: AHK50H-ND_THERM_CONNECTOR (P5.23), CD74HC4067_MUX_5 (U14.3)
TS_IN5_24: AHK50H-ND_THERM_CONNECTOR (P5.24), CD74HC4067_MUX_5 (U14.2)
TS_IN5_25: AHK50H-ND_THERM_CONNECTOR (P5.25), CD74HC4067_MUX_5 (U14.16)
TS_IN5_26: AHK50H-ND_THERM_CONNECTOR (P5.26), CD74HC4067_MUX_5 (U14.17)
TS_IN5_27: AHK50H-ND_THERM_CONNECTOR (P5.27), CD74HC4067_MUX_5 (U14.18)
TS_IN5_28: AHK50H-ND_THERM_CONNECTOR (P5.28), CD74HC4067_MUX_5 (U14.19)
TS_IN5_29: AHK50H-ND_THERM_CONNECTOR (P5.29), CD74HC4067_MUX_5 (U14.20)
TS_IN5_30: AHK50H-ND_THERM_CONNECTOR (P5.30), CD74HC4067_MUX_5 (U14.21)
TS_IN5_31: AHK50H-ND_THERM_CONNECTOR (P5.31), CD74HC4067_MUX_5 (U14.22)
TS_IN5_32: AHK50H-ND_THERM_CONNECTOR (P5.32), CD74HC4067_MUX_5 (U14.23)
TS_IN5_33: AHK50H-ND_THERM_CONNECTOR (P5.33), CD74HC4067_MUX_5 (U15.9)
TS_IN5_34: AHK50H-ND_THERM_CONNECTOR (P5.34), CD74HC4067_MUX_5 (U15.8)
TS_IN5_35: AHK50H-ND_THERM_CONNECTOR (P5.35), CD74HC4067_MUX_5 (U15.7)
TS_IN5_36: AHK50H-ND_THERM_CONNECTOR (P5.36), CD74HC4067_MUX_5 (U15.6)
TS_IN5_37: AHK50H-ND_THERM_CONNECTOR (P5.37), CD74HC4067_MUX_5 (U15.5)
TS_IN5_38: AHK50H-ND_THERM_CONNECTOR (P5.38), CD74HC4067_MUX_5 (U15.4)
TS_IN5_39: AHK50H-ND_THERM_CONNECTOR (P5.39), CD74HC4067_MUX_5 (U15.3)
TS_IN5_40: AHK50H-ND_THERM_CONNECTOR (P5.40), CD74HC4067_MUX_5 (U15.2)
TS_IN5_41: AHK50H-ND_THERM_CONNECTOR (P5.41), CD74HC4067_MUX_5 (U15.16)
TS_IN5_42: AHK50H-ND_THERM_CONNECTOR (P5.42), CD74HC4067_MUX_5 (U15.17)
TS_IN5_43: AHK50H-ND_THERM_CONNECTOR (P5.43), CD74HC4067_MUX_5 (U15.18)
TS_IN5_44: AHK50H-ND_THERM_CONNECTOR (P5.44), CD74HC4067_MUX_5 (U15.19)
TS_IN5_45: AHK50H-ND_THERM_CONNECTOR (P5.45), CD74HC4067_MUX_5 (U15.20)
TS_IN5_46: AHK50H-ND_THERM_CONNECTOR (P5.46), CD74HC4067_MUX_5 (U15.21)
TS_IN5_47: AHK50H-ND_THERM_CONNECTOR (P5.47), CD74HC4067_MUX_5 (U15.22)
TS_IN5_48: AHK50H-ND_THERM_CONNECTOR (P5.48), CD74HC4067_MUX_5 (U15.23)